# Altium schematic sheet IMU_Breakout_SCH.SchDoc
size A
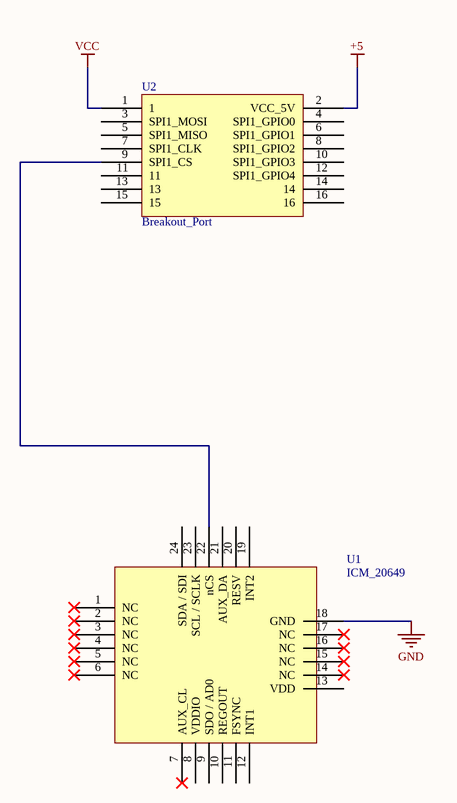
[diagram p0: IMU_Breakout_SCH.SchDoc]

## Parts
U1  ICM_20649
U2  Breakout_Port

## Nets
+5: U2.2(VCC_5V)
GND: U1.18(GND)
VCC: U2.1
NetU1_22: U1.22(nCS) U2.9(SPI1_CS)

Not connected (* = marked no-connect by the designer): U1 1(NC)* 2(NC)* 3(NC)* 4(NC)* 5(NC)* 6(NC)* 7(AUX_CL)* 8(VDDIO) 9(SDO_/_AD0) 10(REGOUT) 11(FSYNC) 12(INT1) 13(VDD) 14(NC)* 15(NC)* 16(NC)* 17(NC)* 19(INT2) 20(RESV) 21(AUX_DA) 23(SCL_/_SCLK) 24(SDA_/_SDI); U2 3(SPI1_MOSI) 4(SPI1_GPIO0) 5(SPI1_MISO) 6(SPI1_GPIO1) 7(SPI1_CLK) 8(SPI1_GPIO2) 10(SPI1_GPIO3) 11 12(SPI1_GPIO4) 13 14 15 16

## Library data of the parts
U1 = ICM_20649: IMU